# EasyEDA Pro project linux-card.eprj, board PCB1
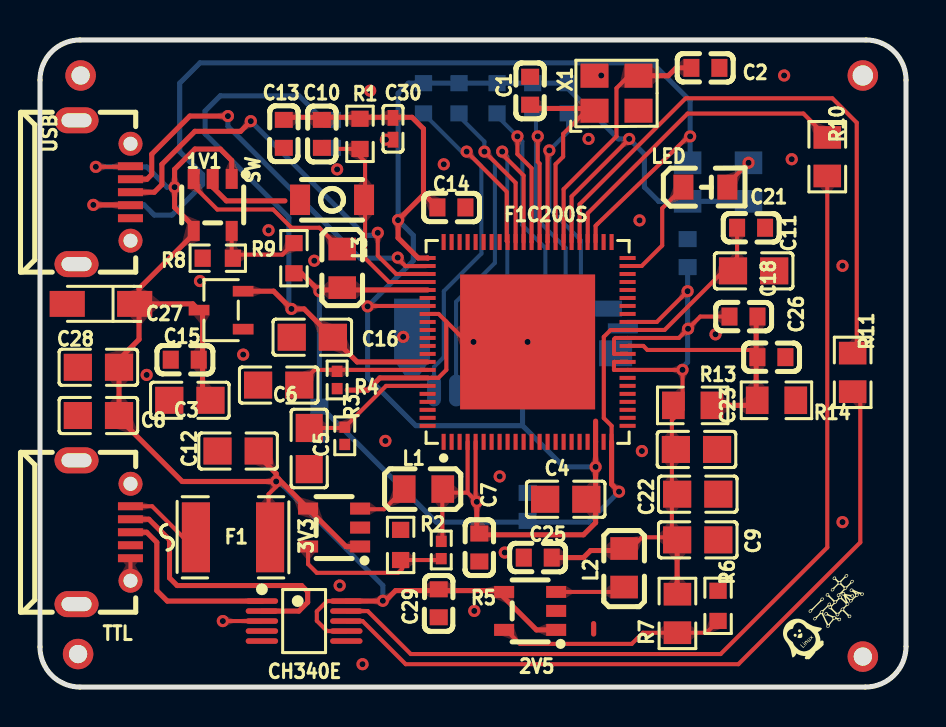
[diagram p4: board, top side]
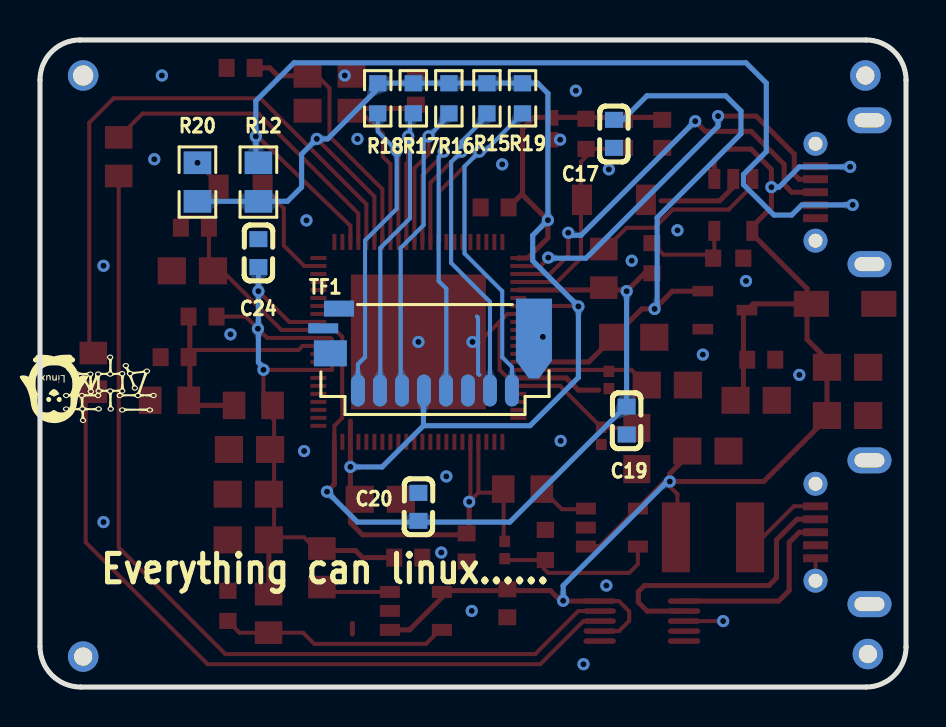
[diagram p5: board, bottom side, seen from below]

Outline 43.31 x 32.39 mm; copper layers: Top Layer, Bottom Layer. Coordinates in mm from the lower left corner of the outline.
Outline path: 0,30.39 0,2 arc(0.59,0.59) 2,0 41.28,0 arc(42.71,0.6) 43.31,2.03 43.31,30.39 arc(42.72,31.8) 41.31,32.39 2,32.39 arc(0.59,31.8) 0,30.39
Stack: Top Layer 0.035mm / 介电1 1.51mm FR4 er 4.5 / Bottom Layer 0.035mm

## Design rules (mm)
spacing Common (default): track to track 0.152, other pairs 0.152 to 0.3
track width Common (default): min 0.127, default 0.254, max 2.54
differential pair Common (default): width min 0.127, default 0.254, max 2.54; gap min 0.152, default 0.152
via Common (default): diameter min 0.5, default 0.61, max 10; hole min 0.3, default 0.305, max 6

## Placement (name value [footprint] x y rotation side)
1V1  -  [SOT-23-5_L3.0-W1.7-P0.95-LS2.8-BR]  8.64 24.13 90 top
2V5  -  [SOT-23-5_L3.0-W1.7-P0.95-LS2.8-BR]  24.51 3.81 0 top
3V3  -  [SOT-23-5_L3.0-W1.7-P0.95-LS2.8-BR]  14.71 7.98 0 top
C1  15pF  [C0603]  24.51 29.84 90 top
C2  15pF  [C0603]  33.27 30.99 0 top
C3  10uF  [C0805]  7.49 14.35 0 top
C4  10uF  [C0805]  26.29 9.4 0 top
C5  1uF  [C0805]  13.46 11.94 270 top
C6  1uF  [C0805]  11.94 15.11 180 top
C7  100nF  [C0603]  21.97 6.98 90 top
C8  10uF  [C0805]  2.92 13.59 0 top
C9  10uF  [C0805]  32.89 7.37 180 top
C10  100nF  [C0603]  14.1 27.69 90 top
C11  10uF  [C0805]  35.69 20.83 180 top
C12  10uF  [C0805]  9.91 11.81 0 top
C13  100nF  [C0603]  12.19 27.69 270 top
C14  100nF  [C0603]  20.57 24 180 top
C15  4.7uF  [C0603]  7.24 16.38 180 top
C16  10uF  [C0805]  13.62 17.51 0 top
C17  100nF  [C0603]  14.61 27.69 90 bottom
C18  100nF  [C0603]  35.18 18.54 180 top
C19  100nF  [C0603]  13.97 13.33 90 bottom
C20  100nF  [C0603]  24.38 9.02 270 bottom
C21  100nF  [C0603]  35.56 22.99 180 top
C22  10uF  [C0805]  32.89 9.65 180 top
C23  1uF  [C0805]  32.83 11.89 180 top
C24  100nF  [C0603]  32.39 21.72 270 bottom
C25  100nF  [C0603]  24.89 6.48 0 top
C26  100nF  [C0603]  36.58 16.51 180 top
C27  1uF  [cap-smd_l3.2-w1.6-rd]  3.05 19.18 180 top
C28  10uF  [C0805]  2.92 16 0 top
C29  100nF  [C0603]  19.94 4.19 90 top
C30  100nF  [C0402]  17.65 27.94 90 top
CH340E  -  [MSOP-10_L3.0-W3.0-P0.50-LS5.0-BL]  13.21 3.3 270 top
F1  -  [F1812]  9.65 7.49 0 top
F1C200S  F1C200S  [QFN-88_L10.0-W10.0-P0.40-BL-EP6.75]  24.38 17.27 0 top
L1  2.2uH  [L0805]  19.18 9.91 0 top
L2  2.2uH  [L0805]  29.21 5.97 90 top
L3  2.2uH  [L0805]  15.11 20.95 270 top
LED  RF-BGB170TS-CB-E0  [led0805-rd_blue]  33.27 25.02 0 top
NOREF  -  [Pad_e3171]  41.15 30.61 0 top
NOREF#2  -  [Pad_e3181]  2.03 30.61 0 top
NOREF#3  -  [Pad_e4167]  1.91 1.65 0 top
NOREF#4  -  [Pad_e3173]  41.15 1.52 0 top
R1  10kΩ  [R0603]  16 27.69 90 top
R2  150kΩ  [R0603]  18.03 7.11 270 top
R3  200kΩ  [R0402]  15.24 12.57 270 top
R4  200kΩ  [R0402]  14.86 15.37 270 top
R5  680kΩ  [R0402]  20.07 6.86 90 top
R6  150kΩ  [R0603]  33.91 4.06 270 top
R7  470kΩ  [R0805]  31.88 3.68 90 top
R8  150kΩ  [R0603]  8.89 21.46 0 top
R9  150kΩ  [R0603]  12.7 21.46 270 top
R10  470kΩ  [R0805]  39.37 26.54 90 top
R11  470kΩ  [R0805]  40.64 15.75 90 top
R12  10kΩ  [R0805]  32.39 25.27 270 bottom
R13  2.2kΩ  [R0805]  32.64 14.1 180 top
R14  2.2kΩ  [R0805]  36.83 14.35 180 top
R15  10kΩ  [R0603]  20.95 29.46 90 bottom
R16  10kΩ  [R0603]  22.86 29.46 90 bottom
R17  10kΩ  [R0603]  24.64 29.46 90 bottom
R18  10kΩ  [R0603]  26.42 29.46 90 bottom
R19  10kΩ  [R0603]  19.18 29.46 270 bottom
R20  1kΩ  [R0805]  35.43 25.27 270 bottom
SW  TS20AN60A25B035  [key-smd_l3.0-w2.0-ls3.5]  14.61 24.38 0 top
TF1  HYCW104-TF08-375B  [TF-SMD_HYCW104-TF08-375B]  23.88 16.89 180 bottom
TTL  920-E52A2021S10100  [micro-usb-smd_5p-p0.65-h-f_c10418]  3.18 7.75 270 top
USB  920-E52A2021S10100  [micro-usb-smd_5p-p0.65-h-f_c10418]  3.18 24.77 270 top
X1  24MHz  [OSC-SMD_4P-L3.2-W2.5-BL]  28.83 29.72 0 top
XC6206P302MR  -  [SOT-23-3_L3.0-W1.7-P0.95-LS2.9-BR]  9.06 18.86 0 top

## Footprints (pads in the part's own frame, mm; a bottom-side part is the same pattern mirrored in y, then rotated)
C0402
  rect 0.79x0.541 smd: 1(-0.546,0) 2(0.546,0)
C0603
  rect 0.8x0.9 smd: 1(-0.7,0) 2(0.7,0)
C0805
  rect 1.409x1.351 smd: 1(-1.028,0) 2(1.031,0)
cap-smd_l3.2-w1.6-rd
  rect 1.758x1.296 smd: 1(-1.687,0) 2(1.687,0)
F1812
  rect 1.407x3.5 smd: 1(-1.854,0) 2(1.854,0)
key-smd_l3.0-w2.0-ls3.5
  rect 1.001x1.524 smd: 1(-1.6,0) 2(1.6,0)
L0805
  rect 1.133x1.377 smd: 1(-0.965,0) 2(0.965,0)
led0805-rd_blue
  rect 1.001x1.25 smd: 1(-1.1,0) 2(1.1,0)
micro-usb-smd_5p-p0.65-h-f_c10418
  oval 1.3x2.2 hole 0.701x1.501: 0(-3.599,-1.349) 0(3.599,-1.349)
  round 1.199 hole 0.701: 0(-2.425,1.351) 0(2.425,1.351)
  rect 0.399x1.25 smd: 1(-1.3,1.349) 2(-0.65,1.349) 3(0,1.349) 4(0.65,1.349) 5(1.3,1.349)
MSOP-10_L3.0-W3.0-P0.50-LS5.0-BL
  oval 0.28x1.621 smd: 1(-1.001,-2.111) 2(-0.5,-2.111) 3(0,-2.111) 4(0.5,-2.111) 5(1.001,-2.111) 6(1.001,2.111) 7(0.5,2.111) 8(0,2.111) 9(-0.5,2.111) 10(-1.001,2.111)
OSC-SMD_4P-L3.2-W2.5-BL
  rect 1.399x1.199 smd: 1(-1.1,-0.874) 2(1.1,-0.874) 3(1.1,0.876) 4(-1.1,0.876)
Pad_e3171
  round 1.524 hole 1.016: (0,0)
Pad_e3173
  round 1.524 hole 0.914: (0,0)
Pad_e3181
  round 1.524 hole 0.914: (0,0)
Pad_e4167
  round 1.524 hole 0.914: (0,0)
QFN-88_L10.0-W10.0-P0.40-BL-EP6.75
  rect 0.2x0.8 smd: 1(-4.2,-5) 2(-3.8,-5) 3(-3.4,-5) 4(-3,-5) 5(-2.6,-5) 6(-2.2,-5) 7(-1.8,-5) 8(-1.4,-5) 9(-1,-5) 10(-0.6,-5) 11(-0.2,-5) 12(0.2,-5) 13(0.6,-5) 14(1,-5) 15(1.4,-5) 16(1.8,-5) 17(2.2,-5) 18(2.6,-5) 19(3,-5) 20(3.4,-5) 21(3.8,-5) 22(4.2,-5) 45(4.2,5) 46(3.8,5) 47(3.4,5) 48(3,5) 49(2.6,5) 50(2.2,5) 51(1.8,5) 52(1.4,5) 53(1,5) 54(0.6,5) 55(0.2,5) 56(-0.2,5) 57(-0.6,5) 58(-1,5) 59(-1.4,5) 60(-1.8,5) 61(-2.2,5) 62(-2.6,5) 63(-3,5) 64(-3.4,5) 65(-3.8,5) 66(-4.2,5)
  rect 0.8x0.2 smd: 23(5,-4.2) 24(5,-3.8) 25(5,-3.4) 26(5,-3) 27(5,-2.6) 28(5,-2.2) 29(5,-1.8) 30(5,-1.4) 31(5,-1) 32(5,-0.6) 33(5,-0.2) 34(5,0.2) 35(5,0.6) 36(5,1) 37(5,1.4) 38(5,1.8) 39(5,2.2) 40(5,2.6) 41(5,3) 42(5,3.4) 43(5,3.8) 44(5,4.2) 67(-5,4.2) 68(-5,3.8) 69(-5,3.4) 70(-5,3) 71(-5,2.6) 72(-5,2.2) 73(-5,1.8) 74(-5,1.4) 75(-5,1) 76(-5,0.6) 77(-5,0.2) 78(-5,-0.2) 79(-5,-0.6) 80(-5,-1) 81(-5,-1.4) 82(-5,-1.8) 83(-5,-2.2) 84(-5,-2.6) 85(-5,-3) 86(-5,-3.4) 87(-5,-3.8) 88(-5,-4.2)
  rect 6.75x6.75 smd: 89(0,0)
R0402
  rect 0.567x0.541 smd: 1(-0.432,0) 2(0.432,0)
R0603
  rect 0.807x0.864 smd: 1(-0.754,0) 2(0.754,0)
R0805
  rect 1.133x1.377 smd: 1(-0.965,0) 2(0.965,0)
SOT-23-3_L3.0-W1.7-P0.95-LS2.9-BR
  rect 1.036x0.531 smd: 1(1.103,-0.95) 2(1.103,0.95) 3(-1.103,0)
SOT-23-5_L3.0-W1.7-P0.95-LS2.8-BR
  rect 1.001x0.6 smd: 1(1.3,-0.95) 2(1.3,0) 3(1.3,0.95) 4(-1.3,0.95) 5(-1.3,-0.95)
TF-SMD_HYCW104-TF08-375B
  oval 0.7x1.6 smd: 1(-3.53,-2.05) 2(-2.43,-2.05) 3(-1.33,-2.05) 4(-0.23,-2.05) 5(0.87,-2.05) 6(1.97,-2.05) 7(3.07,-2.05) 8(4.17,-2.05)
  rect 1.5x0.5 smd: 9(-5.27,1.06)
  rect 1.5x0.8 smd: 10(-4.48,2.05)
  rect 1.65x1.3 smd: 11(-4.91,-0.19)
  custom 1.8x4 smd: 11(5.27,0.55)

## Nets
5VIN: 1V1.1 1V1.4 2V5.1 2V5.4 3V3.1 3V3.4 C3.2 C8.2 C12.2 C15.1 C27.1 C28.2 C29.2 CH340E.7 CH340E.10 F1.2 USB.1 XC6206P302MR.3
+1V1: C11.2 C19.2 C20.2 C21.2 F1C200S.22 F1C200S.35 F1C200S.71 L3.2 R9.2
+2V5: C9.2 C18.2 C22.2 C23.2 C24.2 C25.2 F1C200S.30 F1C200S.31 F1C200S.32 F1C200S.34 F1C200S.36 L2.2 R7.2 R13.2
+3V0: C16.2 C17.2 F1C200S.80 XC6206P302MR.2
+3V3: C4.2 C7.2 C10.2 C13.1 C14.2 C30.2 F1C200S.4 F1C200S.5 F1C200S.20 F1C200S.50 F1C200S.67 F1C200S.73 L1.2 R1.2 R5.2 R12.2 R15.2 R16.2 R17.2 R18.2 R19.1 R20.2 TF1.4
GND: 1V1.2 2V5.2 3V3.2 C1.2 C2.2 C3.1 C4.1 C5.2 C6.2 C7.1 C8.1 C9.1 C10.1 C11.1 C12.1 C13.2 C14.1 C15.2 C16.1 C17.1 C19.1 C20.1 C21.1 C22.1 C23.1 C24.1 C25.1 C26.1 C27.2 C28.1 C29.1 C30.1 CH340E.3 F1C200S.74 F1C200S.82 F1C200S.89 R2.1 R3.2 R4.2 R6.1 R8.1 R14.1 SW.1 TF1.6 TF1.11 TTL.0 TTL.5 USB.0 USB.5 X1.2 X1.4 XC6206P302MR.1
D+: CH340E.1 TTL.3
D-: CH340E.2 TTL.2
DRAM_VREF_33: C18.1 C26.2 F1C200S.33 R13.1 R14.2
DRX: CH340E.8 R11.1
DTX: CH340E.9 R10.1
HOSCI: C2.1 F1C200S.51 X1.3
HOSCO: C1.1 F1C200S.52 X1.1
LED_1: F1C200S.43 LED.1
RESET: F1C200S.70 R1.1 SW.2
SD_CLK: F1C200S.56 TF1.5
SD_CMD: F1C200S.55 R16.1 TF1.3
SD_D0: F1C200S.57 R15.1 TF1.7
SD_D1: F1C200S.58 R19.2 TF1.8
SD_D2: F1C200S.53 R18.1 TF1.1
SD_D3: F1C200S.54 R17.1 TF1.2
USB_ID: F1C200S.47 R12.1 USB.4
USB_N: F1C200S.68 USB.2
USB_P: F1C200S.69 USB.3
$2N23: F1.1 TTL.1
$2N298: LED.2 R20.1
$3N427: C6.1 F1C200S.81 R4.1
$3N428: 1V1.5 R8.2 R9.1
$3N433: 2V5.5 R6.2 R7.1
$3N466: 3V3.5 R2.2 R5.1
$3N467: 1V1.3 L3.1
$3N468: 2V5.3 L2.1
$3N475: 3V3.3 L1.1
$3N803: F1C200S.49 R11.2
$3N815: F1C200S.48 R10.2
$3N9743: C5.1 F1C200S.83 R3.1

Pads without a net: CH340E 4 5 6; F1C200S 1 2 3 6 7 8 9 10 11 12 13 14 15 16 17 18 19 21 23 24 25 26 27 28 29 37 38 39 40 41 42 44 45 46 59 60 61 62 63 64 65 66 72 75 76 77 78 79 84 85 86 87 88; TF1 9 10; TTL 4

## Via types
v1: diameter 0.61, hole 0.305, Top Layer to Bottom Layer, 56 vias

## Routing (per net, layer and track width the routed paths; a pad name or vN(x,y) marks a point on that pad's centre or on a via; arc(x,y) is an arc through that point)
5VIN: length 75.3
  Top Layer w0.203: CH340E.7 14.36,2.8 13.84,3.31 13.84,3.79 14.36,4.3 CH340E.10 ; v1(2.79,26.03) 4.49,26.03 USB.1 ; v1(11.81,10.29) 11.81,10.03 11.43,9.65 11.43,8.05
  Top Layer w0.254: v1(11.81,10.29) 11.81,10.68 10.92,11.57 10.92,11.95 ; v1(11.81,10.29) 11.93,10.41 3V3.4 15.31,7.03 3V3.1 ; v1(11.81,10.29) 7.11,10.29 3.95,13.45 C28.2 3.95,16.4 4.95,17.4 4.95,19.18 ; 2V5.1 24.83,2.86 22.86,4.83 17.78,4.83 17.14,4.19 ; 4.95,19.18 4.95,19.94 7.69,22.67 7.69,23.05 6.73,24 v1(6.73,25.02) 6.73,25.91 7.75,26.92 9.02,26.92 9.59,26.36 1V1.1 ; 4.95,19.18 7.64,19.18 8.13,18.69 8.13,14.75 ; CH340E.10 17.03,4.3 17.14,4.19 ; 17.14,4.19 v1(17.14,4.32)
  Bottom Layer w0.254: v1(2.79,26.03) 5.33,26.03 6.35,25.02 v1(6.73,25.02) ; v1(11.81,10.29) 11.94,10.29 17.14,5.08 v1(17.14,4.32)
+1V1: length 48.4
  Top Layer w0.203: 34.86,22.86 34.86,21.5 31.24,17.87 F1C200S.35 28.54,17.87 28.19,17.53 28.19,13.46 28.58,13.07 28.58,12.27
  Top Layer w0.254: R9.2 13.07,20.71 v1(13.97,19.81) 14.03,19.87 19.39,19.87 ; 28.58,12.27 28.58,10.15 28.83,9.91
  Bottom Layer w0.254: v1(28.96,9.78) 27.43,8.25 19.81,8.25 13.97,14.1 v1(13.97,19.81)
+2V5: length 39.4
  Top Layer w0.203: 32.13,15.87 32,15.87 ; 32.13,15.87 v1(32.13,15.88) 32.13,16 ; 32.13,15.87 32.13,13.89 31.6,13.36 31.6,7.49 30.1,7.49 29.26,6.65 ; 32,15.87 F1C200S.30 28.71,15.87 28.7,15.88 28.7,16.26 28.71,16.27 F1C200S.31 ; 32,15.87 32.13,16 ; 32.13,16 32.17,16 ; 32.26,15.99 32.26,16 32.25,16 ; v1(32.39,19.81) 30.85,18.27 F1C200S.36 ; C18.2 33.02,18.54 v1(32.41,17.93) 31.95,17.47 F1C200S.34 28.78,17.47 28.7,17.4 28.7,16.67 F1C200S.32
  Top Layer w0.254: C9.2 31.86,5.19 31.42,4.75 ; 29.26,6.65 29.08,6.83 27.53,6.83 27.18,6.48 C25.2
  Bottom Layer w0.254: v1(32.13,15.88) 32.13,16 32.39,16.26 v1(32.39,19.81) C24.2
+3V0: length 29.6
  Top Layer w0.254: 19.39,16.27 15.86,16.27 13.21,18.92 v1(12.57,18.92) 11.68,19.81 XC6206P302MR.2
  Bottom Layer w0.254: v1(12.57,18.92) 12.45,19.05 12.45,23.5 8.26,27.69 8.26,28.83 9.02,29.59 12.95,29.59 14.16,28.39 C17.2
+3V3: length 99.5
  Top Layer w0.203: 19.39,19.07 16.41,19.07 v1(16.38,19.05) ; 21.38,9.73 21.78,9.33 21.78,12.27 ; 21.38,9.73 21.38,12.27 ; 21.38,9.73 20.4,9.73 20.12,9.45 20.12,7.34 R5.2 ; 26.58,22.27 26.58,24.55 v1(29.46,27.43)
  Top Layer w0.254: 27.79,13.31 v1(27.79,11.02) 27.79,8.23 27.18,7.62 21.84,7.62 v1(21.84,9.27) 21.78,9.33 ; v1(17.91,23.37) 17.91,22.48 18.91,21.47 19.39,21.47 19.39,21.46 ; v1(17.91,23.37) 18.08,23.37 ; v1(17.91,23.37) 19.18,24.64 ; 19.18,24.64 19.18,27.94 18.6,28.51 12.57,28.51 ; 19.18,24.64 19.24,24.64 C14.2
  Bottom Layer w0.254: R20.2 R12.2 30.94,24.31 30.23,25.02 30.23,26.67 v1(29.46,27.43) 28.92,27.43 26.13,30.23 18.42,30.23 17.91,29.71 v1(17.91,23.37) 18.67,22.61 18.67,21.34 v1(16.38,19.05) 16.38,15.49 18.8,13.08 24.13,13.08 ; v1(27.79,11.02) 26.19,11.02 24.13,13.08 ; TF1.4 24.13,14.82 24.13,13.08
GND: length 24.2
  Top Layer w0.203: F1C200S.74 19.94,18.67 20.32,18.29 ; 4.52,5.32 TTL.5 ; 20.32,18.29 21.34,17.27 v1(21.68,17.27) v1(24.38,17.27) ; 20.32,18.29 20.32,15.88 19.92,15.47 19.39,15.47 ; CH340E.3 v1(9.14,3.3)
  Top Layer w0.254: 27.69,2.65 27.69,3.17 ; 12.25,24.33 9.32,24.33 8.64,25.02 1V1.2 ; 15.37,14.86 16.38,14.86 17,15.47 19.39,15.47
  Bottom Layer w0.203: 21.46,18.54 21.4,18.48 21.4,15.68 21.34,15.62
  vias: v1(5.33,15.62) v1(8,20.32) v1(10.16,16.64) v1(11.43,22.86) v1(13.72,21.34) v1(14.86,25.91) v1(14.99,5.08) v1(16.13,1.14) v1(16.51,29.84) v1(17.3,27.39) v1(17.27,12.32) v1(18.16,17.53) v1(20.19,26.16) v1(21.72,3.81) v1(22.99,10.54) v1(23.24,6.73) v1(27.43,27.43) v1(28.07,30.61) v1(29.98,23.36) v1(30.1,11.81) v1(33.78,17.65) v1(37.21,30.61) v1(37.59,26.42) v1(40.13,21.08) v1(40.13,8.25)
D+: length 9.4
  Top Layer w0.254: TTL.3 5.33,7.75 5.84,7.24 5.84,4.83 6.36,4.3 CH340E.1
D-: length 14.5
  Top Layer w0.254: CH340E.2 12.95,3.8 13.39,4.24 13.39,4.78 13.08,5.08 6.86,5.08 6.48,5.46 6.48,7.37 5.45,8.4 TTL.2
DRAM_VREF_33: length 13
  Top Layer w0.203: 35.81,16.87 30.38,16.87 30.17,17.07 F1C200S.33
  Top Layer w0.254: R13.1 35.43,14.1 35.81,14.48 35.81,18.48 C18.1
DRX: length 36.8
  Top Layer w0.203: CH340E.8 16.13,3.3 18.29,1.14 34.92,1.14 41.02,7.24 41.02,14.4 R11.1
DTX: length 45.7
  Top Layer w0.203: CH340E.9 16.39,3.8 18.54,1.65 34.04,1.65 39.37,6.98 R10.1
HOSCI: length 12.5
  Top Layer w0.203: 29.55,30.47 29.32,30.47 28.83,29.97 28.83,27.56 26.19,24.91 26.19,22.27
  Top Layer w0.254: 32.57,30.99 31.81,30.99 31.42,30.59 X1.3
HOSCO: length 10.6
  Top Layer w0.203: 27.39,28.7 27.18,28.7 26.16,27.69 26.16,26.54 25.78,26.16 25.78,22.27
  Top Layer w0.254: X1.1 27.62,28.96 24.7,28.96 C1.1
LED_1: length 5.5
  Top Layer w0.203: F1C200S.43 30.09,21.07 31.11,22.1 31.11,23.96 LED.1
RESET: length 10.1
  Top Layer w0.203: F1C200S.70 17.45,20.27 16.26,21.46 16.26,26.29 15.61,26.93 14.86,26.93
SD_CLK: length 17.2
  Top Layer w0.203: 24.18,22.27 24.18,25.6 23.11,26.67 v1(23.11,26.8)
  Bottom Layer w0.203: TF1.5 22.99,14.86 22.99,19.94 23.37,20.32 23.37,26.54 v1(23.11,26.8)
SD_CMD: length 20.2
  Top Layer w0.203: v1(23.88,27.56) 23.88,26.67 24.58,25.96 24.58,22.28 24.58,22.27
  Bottom Layer w0.203: 22.86,28.58 v1(23.88,27.56) 24.12,27.31 24.12,23.12 25.27,21.97 25.27,14.94
SD_D0: length 20.3
  Top Layer w0.203: 23.78,22.27 23.78,25.24 v1(22.23,26.8)
  Bottom Layer w0.203: 21.08,28.44 22.23,27.3 v1(22.23,26.8) 22.75,26.27 22.75,21.22 20.81,19.28 20.81,14.84
SD_D1: length 21.4
  Top Layer w0.203: v1(21.34,26.8) 23.34,24.8 23.34,22.32 23.38,22.27
  Bottom Layer w0.203: 19.71,14.84 19.71,16.02 20.19,16.51 20.19,19.81 22.08,21.69 22.08,26.06 v1(21.34,26.8) 21.32,26.78 21.09,26.78 19.3,28.58
SD_D2: length 19.6
  Top Layer w0.203: 25.38,26.76 25.38,22.28 25.39,22.27
  Bottom Layer w0.203: R18.1 26.42,27.8 v1(25.47,26.86) 25.47,23.93 27.05,22.35 27.05,16.51 27.41,16.16 TF1.1
SD_D3: length 20
  Top Layer w0.203: 24.98,22.27 24.98,26.2 24.89,26.29 v1(24.89,27.56)
  Bottom Layer w0.203: 26.31,14.84 26.29,14.86 26.29,21.97 24.8,23.46 24.8,27.47 v1(24.89,27.56) 24.8,27.65 24.8,28.54 R17.1
USB_ID: length 50.9
  Top Layer w0.203: 27.79,22.27 27.79,23.09 27.88,23.18 32.43,27.56
  Top Layer w0.254: USB.4 4.51,24.13 v1(2.67,24.13)
  Bottom Layer w0.254: R12.1 32.51,26.36 v1(32.51,27.56) 32.51,29.34 30.61,31.24 8,31.24 6.98,30.23 6.98,26.8 8.13,25.65 8.13,25.15 6.6,23.62 5.72,23.62 5.21,24.13 v1(2.67,24.13)
USB_N: length 20.4
  Top Layer w0.203: 19.31,21.07 18.28,21.07 17.93,21.41 17.93,21.62 17.83,21.62 17.89,21.56
  Top Layer w0.254: 4.52,25.41 5.35,25.41 5.59,25.65 5.59,26.67 7.49,28.58 v1(9.4,28.58)
  Bottom Layer w0.254: v1(17.89,21.49) 17.86,21.46 16,21.46 9.4,28.07 v1(9.4,28.58)
USB_P: length 20.5
  Top Layer w0.203: 19.39,20.67 17.81,20.67 16.89,21.59 v1(16.89,22.73)
  Top Layer w0.254: v1(10.54,28.32) 10.03,27.81 7.75,27.81 6.1,26.16 6.1,25.15 5.72,24.77 4.88,24.77
  Bottom Layer w0.254: v1(10.54,28.32) 16.26,22.61 16.76,22.61 v1(16.89,22.73)
$2N23: length 3.9
  Top Layer w0.203: TTL.1 5.61,9.05 7.16,7.49 F1.1
$2N298: length 2
  Top Layer w0.203: 34.26,25.18 34.46,24.98 34.46,25.26 v1(35.43,26.24)
$3N427: length 6.7
  Top Layer w0.203: F1C200S.81 13.73,15.87 C6.1
$3N428: length 4.5
  Top Layer w0.203: R9.1 12.12,21.64 9.59,21.64 1V1.5
$3N433: length 11.6
  Top Layer w0.203: 34.04,3.43 33.33,2.72 R7.1 30.15,2.72 29.59,2.16 24,2.16 23.3,2.86
$3N466: length 8.4
  Top Layer w0.203: 20.06,6.42 20,6.36 R2.2 ; 3V3.5 13.41,6.15 13.84,5.72 17.91,5.72 18.11,5.92 18.11,6.28
  Top Layer w0.254: 18.11,6.28 R2.2
$3N467: length 9.1
  Top Layer w0.203: 7.69,25.43 7.69,25.08 8.87,23.9 11.66,23.9 12.57,22.99 13.97,22.99 15.04,21.92 L3.1
$3N468: length 4
  Top Layer w0.203: 29.59,5.33 29.02,4.76 2V5.3
$3N475: length 2.6
  Top Layer w0.203: 16.06,8.9 17.21,8.9 L1.1
$3N803: length 30.1
  Top Layer w0.203: R11.2 40.84,16.92 40.84,28.25 39.62,29.46 32.29,29.46 26.98,24.16 26.98,22.27
$3N815: length 16
  Top Layer w0.203: 27.39,22.27 27.39,23.71 32.39,28.7 38.18,28.7 R10.2
$3N9743: length 6.8
  Top Layer w0.203: F1C200S.83 17.31,15.07 15.2,12.97 C5.1

## Copper pours and planes (outline as drawn; the poured copper is in the pictures)
GND on Top Layer: 0,32.39 43.31,32.39 43.31,0 0,0
GND on Bottom Layer: 0,32.39 43.31,32.39 43.31,0 0,0

Small or netless copper shapes (teardrops, artwork), in the pictures only: 169 on Top Layer, 68 on Bottom Layer

## Text on the board
Bottom Silkscreen Layer: Everything can linux……
